# EAGLE design bcu-rs232 (EAGLE 4.16)
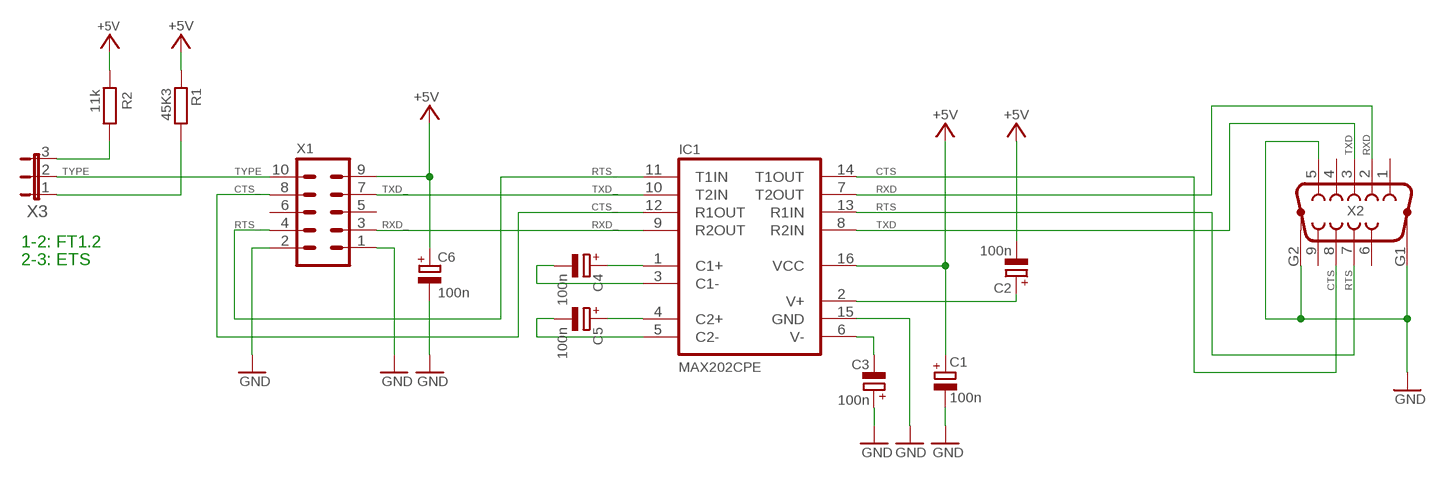
[diagram p0: schematic, sheet 1]

## Parts
C1  100n  CPOL-EUE2-5  [E2-5]
C2  100n  CPOL-EUE2-5  [E2-5]
C3  100n  CPOL-EUE2-5  [E2-5]
C4  100n  CPOL-EUE2-5  [E2-5]
C5  100n  CPOL-EUE2-5  [E2-5]
C6  100n  CPOL-EUE2-5  [E2-5]
IC1  MAX202CPE  [DIL16]
R1  45K3  R-EU_0207/10  [0207/10]
R2  11k  R-EU_0207/10  [0207/10]
X1  ML10  [ML10]
X2  F09HP  [F09HP]
X3  JP2E  [JP2]

## Nets
+5V: C1.+ C2.- C6.+ IC1.16(VCC) R1.1 R2.1 X1.9
CTS: IC1.14(T1OUT) X2.8
CTS_: IC1.12(R1OUT) X1.8
GND: C1.- C3.+ C6.- IC1.15(GND) X1.1 X1.2 X2.5 X2.G1 X2.G2
N$1: C4.+ IC1.1(C1+)
N$2: C4.- IC1.3(C1-)
N$3: C5.+ IC1.4(C2+)
N$4: C5.- IC1.5(C2-)
N$11: R2.2 X3.3
N$12: R1.2 X3.1
RTS: IC1.13(R1IN) X2.7
RTS_: IC1.11(T1IN) X1.4
RXD: IC1.7(T2OUT) X2.2
RXD_: IC1.9(R2OUT) X1.3
TXD: IC1.8(R2IN) X2.3
TXD_: IC1.10(T2IN) X1.7
TYPE: X1.10 X3.2
V+: C2.+ IC1.2(V+)
V-: C3.- IC1.6(V-)
Unconnected: X1.5 X1.6 X2.1 X2.4 X2.6 X2.9

## Notes on the sheet
- 1-2: FT1.2
- 2-3: ETS

## Library data of the parts
C1-C6 = rcl:CPOL-EU: POLARIZED CAPACITOR, European symbol
IC1 = maxim:MAX202CPE: RS232 TRANSEIVER
R1 R2 = rcl:R-EU_: RESISTOR, European symbol
X1 = con-harting-ml:ML10: HARTING
X2 = con-subd:F09HP: SUB-D
X3 = jumper:JP2E: JUMPER

## Net classes
0 default: width 0.305 mm

## Board
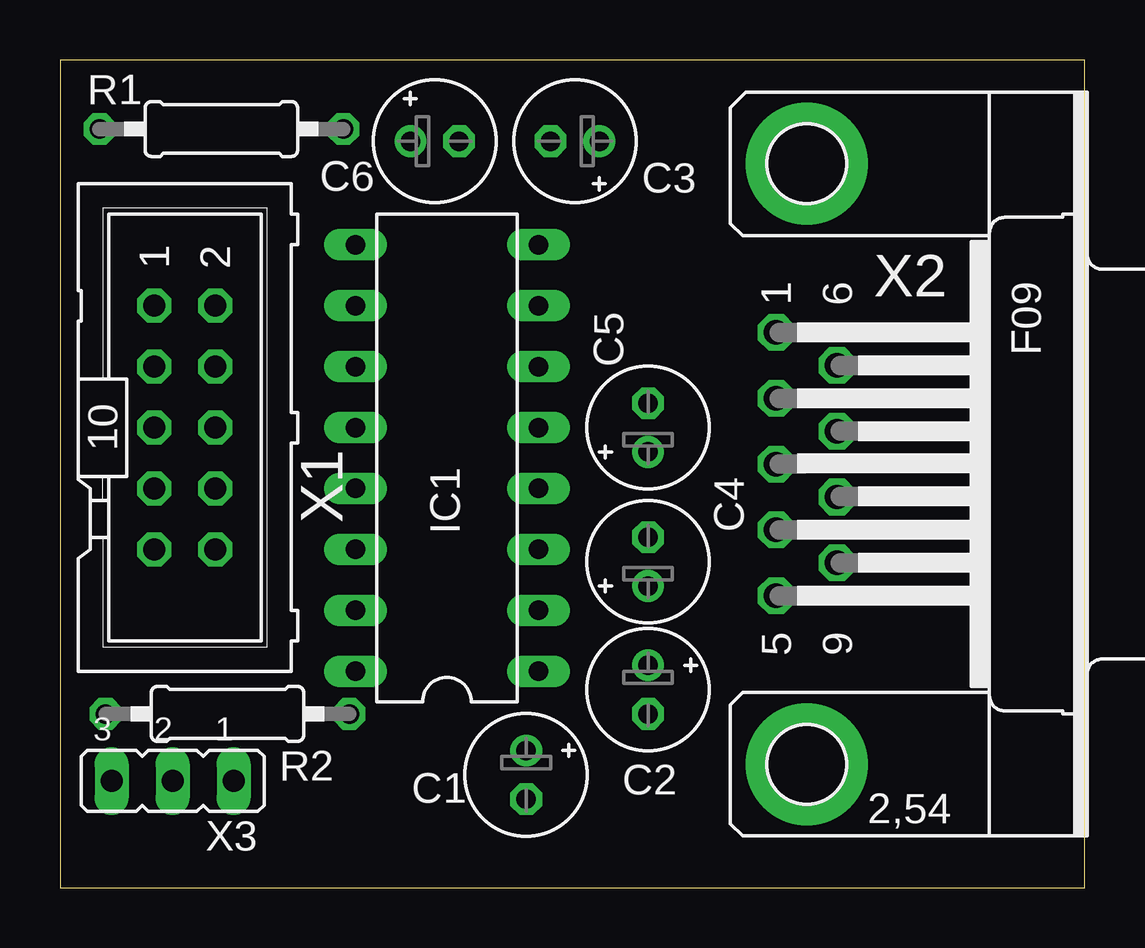
[diagram p1: board, top side]
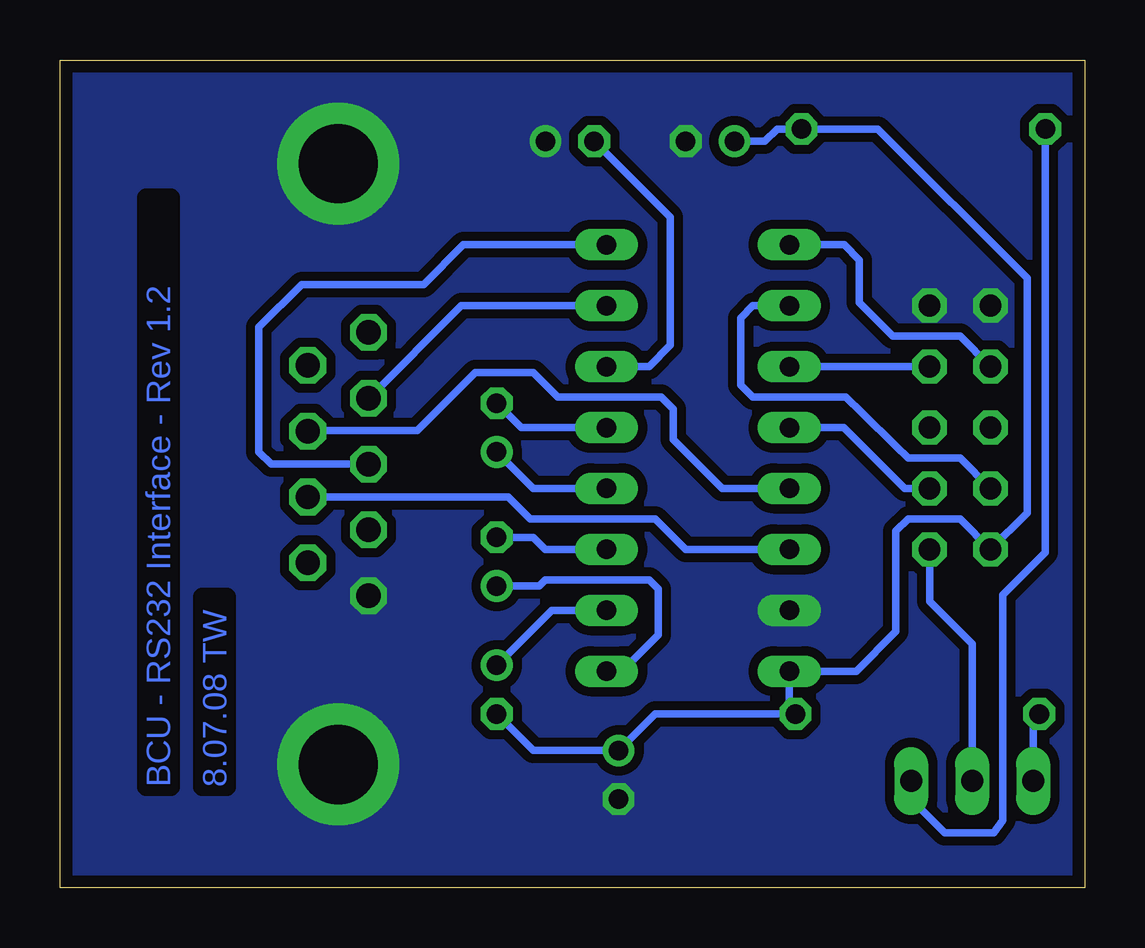
[diagram p2: board, bottom side, seen from below]

Size 42.7 x 34.5 mm. Coordinates in mm from the lower left corner, seen from the top.
Outline: 0,0 42.7,0 42.7,34.5 0,34.5 0,0
Copper layers (1*16): Top 0.035mm / dielectric 1.5mm / Bottom 0.035mm
Design rules "idefix-default": minimum track width 8mil, minimum drill 12mil, track to track 15mil, track to pad 15mil, pad to pad 8mil, via to via 8mil, smd to smd 8mil, copper to edge 20mil, drill to drill 8mil, minimum pad ring 10mil, minimum via ring 8mil, stop-mask expansion 4mil, vias tented up to drill 0mil, thermal gap 10mil

### Footprints (pad centres in the part's own frame; a part is rotated, then mirrored left to right if it is on the bottom)
E2-5 = drill 0.813 pad 1.27 round: + -1.016,0 | drill 0.813 pad 1.27 octagon: - 1.016,0
DIL16 = drill 0.813 long: 1 -8.89,-3.81; 2 -6.35,-3.81; 3 -3.81,-3.81; 4 -1.27,-3.81; 5 1.27,-3.81; 6 3.81,-3.81; 7 6.35,-3.81; 8 8.89,-3.81; 9 8.89,3.81; 10 6.35,3.81; 11 3.81,3.81; 12 1.27,3.81; 13 -1.27,3.81; 14 -3.81,3.81; 15 -6.35,3.81; 16 -8.89,3.81
0207/10 = drill 0.813 octagon: 1 -5.08,0; 2 5.08,0
ML10 = drill 0.914 octagon: 1 -5.08,-1.27; 2 -5.08,1.27; 3 -2.54,-1.27; 4 -2.54,1.27; 5 0,-1.27; 6 0,1.27; 7 2.54,-1.27; 8 2.54,1.27; 9 5.08,-1.27; 10 5.08,1.27
F09HP = drill 1.016 octagon: 1 -5.486,-1.27; 2 -2.743,-1.27; 3 0,-1.27; 4 2.743,-1.27; 5 5.486,-1.27; 6 -4.115,1.27; 7 -1.372,1.27; 8 1.372,1.27; 9 4.115,1.27 | drill 3.302 pad 5.08 round: G1 -12.522,0; G2 12.522,0
JP2 = drill 0.914 long: 1 -2.54,0; 2 0,0; 3 2.54,0

### Placement (x,y rotation side)
C1  19.42,4.7 270 top
C2  24.5,8.25 270 top
C3  21.46,31.11 180 top
C4  24.5,13.59 90 top
C5  24.5,19.18 90 top
C6  15.61,31.11 0 top
IC1  16.12,17.91 90 top
R1  6.72,31.62 180 top
R2  6.98,7.24 180 top
X1  5.2,19.18 270 top
X2  31.11,17.65 270 top
X3  4.69,4.44 180 top

### Tracks (layer width: path | path; a pad name or v marks a point on that pad's centre or on a via)
+5V
  Bottom 0.305: C2.- 22.98,5.71 C1.+ 17.9,7.24 R2.1 12.31,7.49 IC1.16 9.52,9.02 7.87,10.67 7.87,14.86 7.36,15.37 5.2,15.37 X1.9 2.41,15.62 2.41,25.4 8.63,31.62 R1.1 12.82,31.62 13.33,31.11 C6.+
CTS
  Bottom 0.305: IC1.14 16.63,14.1 17.9,15.37 23.11,15.37 24.02,16.28 X2.8
CTS_
  Bottom 0.305: X1.8 7.51,16.64 10.05,19.18 IC1.12
GND
  pour Bottom (no thermals): 0,0 42.7,0 42.7,34.5 0,34.5
N$1
  Bottom 0.305: C4.+ 22.73,12.57 22.47,12.83 18.15,12.83 17.77,12.45 17.77,10.54 19.3,9.02 IC1.1
N$2
  Bottom 0.305: IC1.3 22.47,14.1 22.98,14.6 C4.-
N$3
  Bottom 0.305: IC1.4 22.98,16.64 C5.+
N$4
  Bottom 0.305: IC1.5 23.49,19.18 C5.-
N$11
  Bottom 0.305: X3.3 2.15,6.98 R2.2
N$12
  Bottom 0.305: X3.1 7.23,3.68 5.83,2.29 3.8,2.29 3.42,2.79 3.42,12.19 1.64,13.97 1.64,27.43 | 1.64,27.43 1.64,26.92 | 1.64,27.43 R1.2
RTS
  Bottom 0.305: IC1.13 15.11,16.64 17.14,18.67 17.14,19.94 17.65,20.45 21.96,20.45 22.98,21.46 25.39,21.46 27.81,19.05 32.35,19.05 X2.7
RTS_
  Bottom 0.305: X1.4 IC1.11
RXD
  Bottom 0.305: X2.2 25.98,24.26 IC1.7
RXD_
  Bottom 0.305: X1.3 5.2,22.99 7.99,22.99 9.39,24.38 9.39,26.16 10.03,26.8 IC1.9
TXD
  Bottom 0.305: 34.41,21.84 34.41,18.16 33.9,17.65 X2.3 | 34.41,21.84 34.41,22.99 | IC1.8 25.9,26.8 27.55,25.14 32.63,25.14 34.41,23.37 34.41,21.84
TXD_
  Bottom 0.305: IC1.10 13.84,24.26 14.34,23.75 14.34,20.95 13.84,20.45 9.96,20.45 9.27,19.78 7.87,18.41 7.36,17.91 5.2,17.91 X1.7
TYPE
  Bottom 0.305: X3.2 4.69,10.16 6.47,11.94 X1.10
V+
  Bottom 0.305: IC1.2 22.22,11.56 C2.+
V-
  Bottom 0.305: IC1.6 18.15,21.72 17.27,22.61 17.27,27.94 C3.-

### Text on the board
Bottom: 8.07.08 TW | BCU - RS232 Interface - Rev 1.2